# Altium schematic sheet 5V-and-3V3-buck.SchDoc
size Legal; SheetNumber: 6; SheetTotal: 7
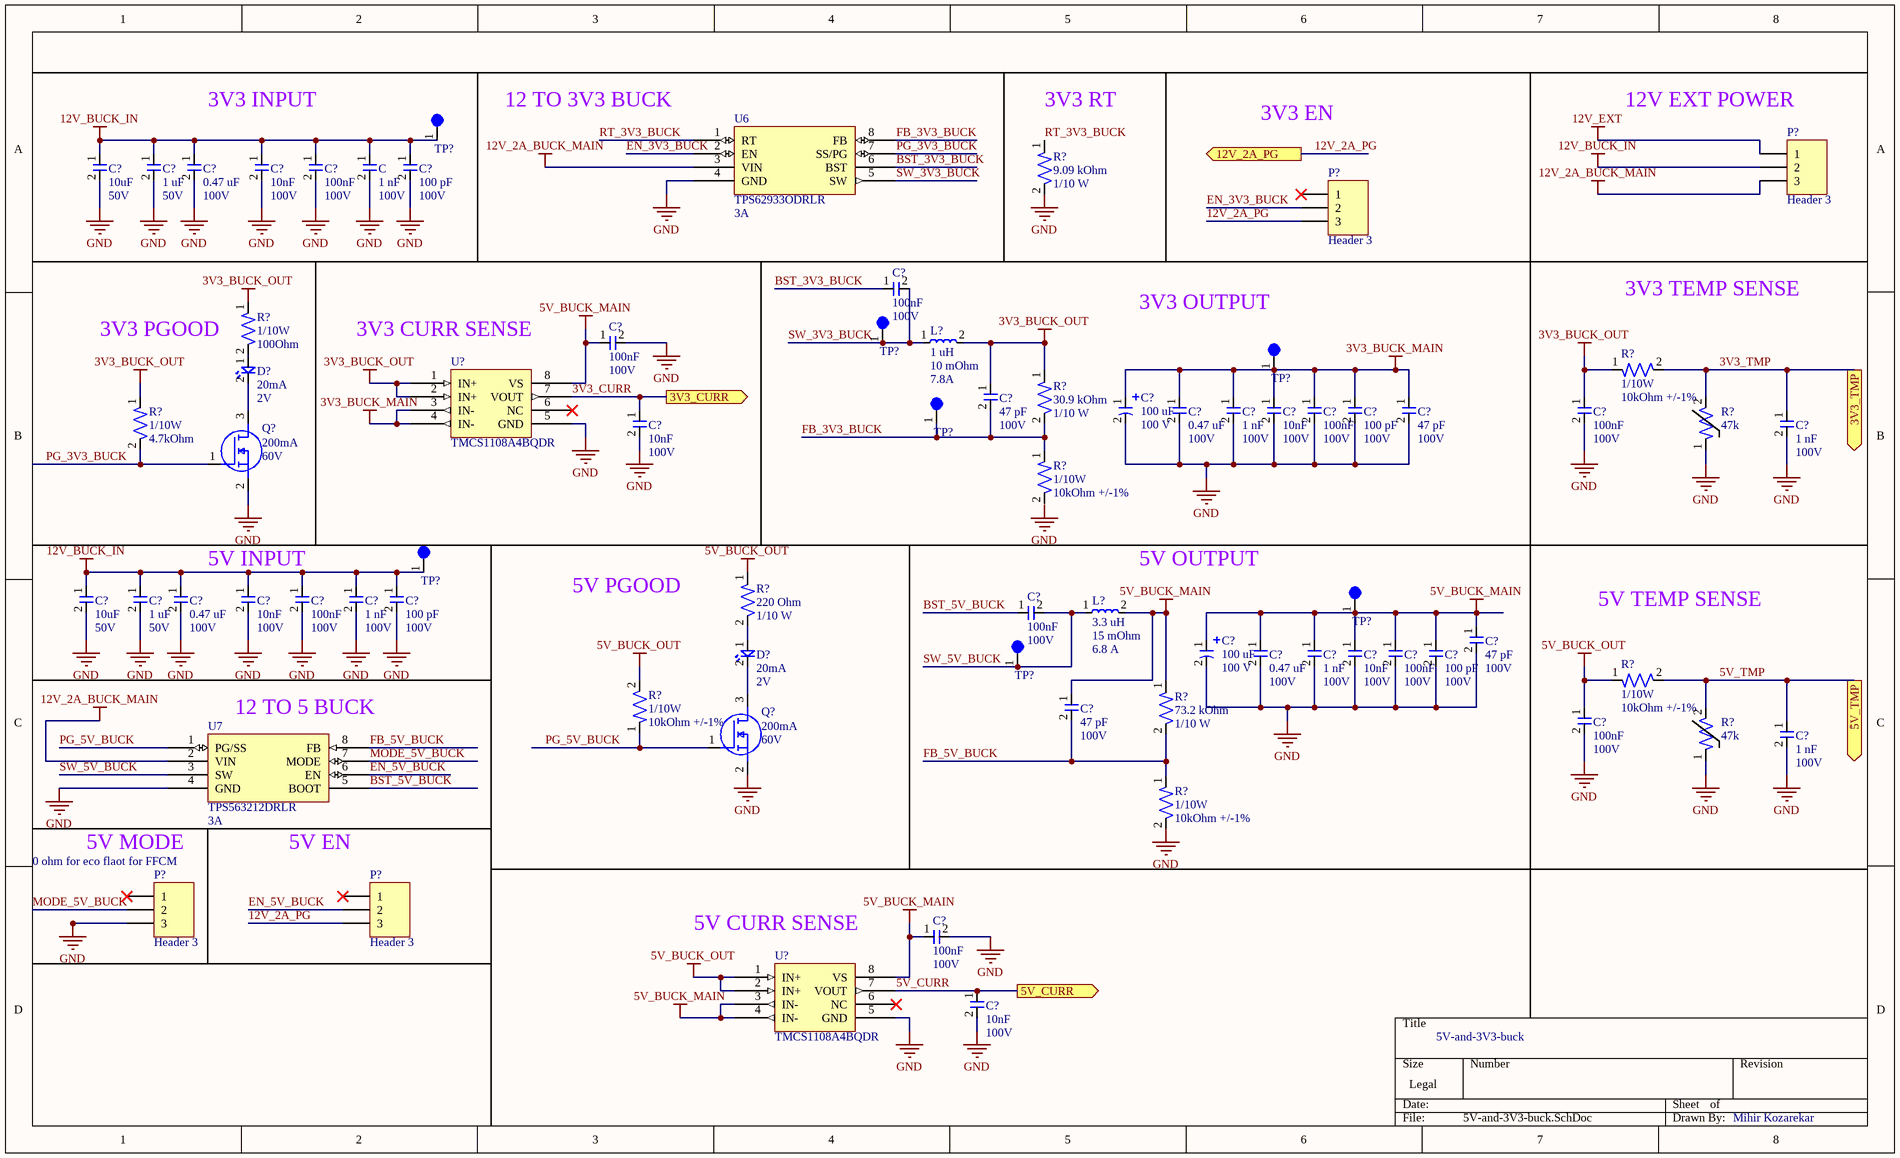
[diagram p0: 5V-and-3V3-buck.SchDoc]

## Parts
(Parts that share a designator on the sheet are numbered #1, #2 ... from top to bottom, then left to right.)
C  Capacitance: 1 nF  Voltage: 100V  [CAP-0603]  (hidden comment: C0603Y102K1RAC7867)
C?#1  Capacitance: 10uF  Voltage Rating: 50V  [CAP-1206]  (hidden comment: CL31B106KBHNNNE)
C?#2  Capacitance: 1 uF  Voltage: 50V  [CAP-0603]  (hidden comment: UMK107AB7105KA-T)
C?#3  Capacitance: 0.47 uF  Voltage: 100V  [CAP-0805]  (hidden comment: KAM21KR72A474KL)
C?#4  Capacitance: 10nF  Voltage Rating: 100V  [CAP-0603]  (hidden comment: C1608C0G2A103J080AC)
C?#5  Capacitance: 100nF  Voltage Rating: 100V  [CAP-0603]  (hidden comment: CC0603KRX7R0BB104)
C?#6  Capacitance: 100 pF  Voltage: 100V  [CAP-0603]  (hidden comment: 0603N101J101CT)
C?#7  Capacitance: 100nF  Voltage Rating: 100V  [CAP-0603]  (hidden comment: CC0603KRX7R0BB104)
C?#8  Capacitance: 100nF  Voltage Rating: 100V  [CAP-0603]  (hidden comment: CC0603KRX7R0BB104)
C?#9  Capacitance: 47 pF  Voltage Rating: 100V  [CAP-0603]  (hidden comment: 7447798111)
C?#10  Capacitance: 100 uF  Voltage: 100 V  [ELEC-100U-0001]  (hidden comment: 100SEV100M12.5X16)
C?#11  Capacitance: 0.47 uF  Voltage: 100V  [CAP-0805]  (hidden comment: KAM21KR72A474KL)
C?#12  Capacitance: 1 nF  Voltage: 100V  [CAP-0603]  (hidden comment: C0603Y102K1RAC7867)
C?#13  Capacitance: 10nF  Voltage Rating: 100V  [CAP-0603]  (hidden comment: C1608C0G2A103J080AC)
C?#14  Capacitance: 100nF  Voltage Rating: 100V  [CAP-0603]  (hidden comment: CC0603KRX7R0BB104)
C?#15  Capacitance: 100 pF  Voltage: 100V  [CAP-0603]  (hidden comment: 0603N101J101CT)
C?#16  Capacitance: 47 pF  Voltage Rating: 100V  [CAP-0603]  (hidden comment: 7447798111)
C?#17  Capacitance: 100nF  Voltage Rating: 100V  [CAP-0603]  (hidden comment: CC0603KRX7R0BB104)
C?#18  Capacitance: 10nF  Voltage Rating: 100V  [CAP-0603]  (hidden comment: C1608C0G2A103J080AC)
C?#19  Capacitance: 1 nF  Voltage: 100V  [CAP-0603]  (hidden comment: C0603Y102K1RAC7867)
C?#20  Capacitance: 10uF  Voltage Rating: 50V  [CAP-1206]  (hidden comment: CL31B106KBHNNNE)
C?#21  Capacitance: 1 uF  Voltage: 50V  [CAP-0603]  (hidden comment: UMK107AB7105KA-T)
C?#22  Capacitance: 0.47 uF  Voltage: 100V  [CAP-0805]  (hidden comment: KAM21KR72A474KL)
C?#23  Capacitance: 10nF  Voltage Rating: 100V  [CAP-0603]  (hidden comment: C1608C0G2A103J080AC)
C?#24  Capacitance: 100nF  Voltage Rating: 100V  [CAP-0603]  (hidden comment: CC0603KRX7R0BB104)
C?#25  Capacitance: 1 nF  Voltage: 100V  [CAP-0603]  (hidden comment: C0603Y102K1RAC7867)
C?#26  Capacitance: 100 pF  Voltage: 100V  [CAP-0603]  (hidden comment: 0603N101J101CT)
C?#27  Capacitance: 100nF  Voltage Rating: 100V  [CAP-0603]  (hidden comment: CC0603KRX7R0BB104)
C?#28  Capacitance: 47 pF  Voltage Rating: 100V  [CAP-0603]  (hidden comment: 7447798111)
C?#29  Capacitance: 100 uF  Voltage: 100 V  [ELEC-100U-0001]  (hidden comment: 100SEV100M12.5X16)
C?#30  Capacitance: 0.47 uF  Voltage: 100V  [CAP-0805]  (hidden comment: KAM21KR72A474KL)
C?#31  Capacitance: 1 nF  Voltage: 100V  [CAP-0603]  (hidden comment: C0603Y102K1RAC7867)
C?#32  Capacitance: 10nF  Voltage Rating: 100V  [CAP-0603]  (hidden comment: C1608C0G2A103J080AC)
C?#33  Capacitance: 100nF  Voltage Rating: 100V  [CAP-0603]  (hidden comment: CC0603KRX7R0BB104)
C?#34  Capacitance: 100 pF  Voltage: 100V  [CAP-0603]  (hidden comment: 0603N101J101CT)
C?#35  Capacitance: 47 pF  Voltage Rating: 100V  [CAP-0603]  (hidden comment: 7447798111)
C?#36  Capacitance: 100nF  Voltage Rating: 100V  [CAP-0603]  (hidden comment: CC0603KRX7R0BB104)
C?#37  Capacitance: 1 nF  Voltage: 100V  [CAP-0603]  (hidden comment: C0603Y102K1RAC7867)
C?#38  Capacitance: 100nF  Voltage Rating: 100V  [CAP-0603]  (hidden comment: CC0603KRX7R0BB104)
C?#39  Capacitance: 10nF  Voltage Rating: 100V  [CAP-0603]  (hidden comment: C1608C0G2A103J080AC)
D?#1  Current Rating: 20mA  Vf: 2V  [LED-0603]  (hidden comment: 150060AS75000)
D?#2  Current Rating: 20mA  Vf: 2V  [LED-0603]  (hidden comment: 150060AS75000)
L?#1  Inductance: 1 uH  DCR: 10 mOhm  DCI: 7.8A  [PWRIND-6.8U-0001]  (hidden comment: SRN8040-1R0Y)
L?#2  Inductance: 3.3 uH  DCR: 15 mOhm  DCI: 6.8 A  [PWRIND-3.3U-0003]  (hidden comment: SRR1240-3R3Y)
P?#1  Header 3  [HDR1X3]
P?#2  Header 3  [HDR1X3]
P?#3  Header 3  [HDR1X3]
P?#4  Header 3  [HDR1X3]
Q?#1  Id-Continuous: 200mA  VDS-Max: 60V  [NMOS-SOT23-3]  (hidden comment: T2N7002AK,LM)
Q?#2  Id-Continuous: 200mA  VDS-Max: 60V  [NMOS-SOT23-3]  (hidden comment: T2N7002AK,LM)
R?#1  Resistance: 9.09 kOhm  Power: 1/10 W  [RES-0603]  (hidden comment: RC0603FR-079K09L)
R?#2  Power Rating: 1/10W  Resistance: 100Ohm  [RES-0603]  (hidden comment: AC0603FR-10100RL)
R?#3  Power Rating: 1/10W  Resistance: 10kOhm +/-1%  [RES-0603]  (hidden comment: RC0603FR-0710KP)
R?#4  Resistance: 30.9 kOhm  Power: 1/10 W  [RES-0603]  (hidden comment: RC0603FR-0730K9L)
R?#5  Power Rating: 1/10W  Resistance: 4.7kOhm  [RES-0603]  (hidden comment: AF0603FR-074K7L)
R?#6  Resistance: 47k  [RES-0402]  (hidden comment: TMP6431DECR)
R?#7  Power Rating: 1/10W  Resistance: 10kOhm +/-1%  [RES-0603]  (hidden comment: RC0603FR-0710KP)
R?#8  Resistance: 220 Ohm  Power: 1/10 W  [RES-0603]  (hidden comment: CRGCQ0603J220R)
R?#9  Power Rating: 1/10W  Resistance: 10kOhm +/-1%  [RES-0603]  (hidden comment: RC0603FR-0710KP)
R?#10  Power Rating: 1/10W  Resistance: 10kOhm +/-1%  [RES-0603]  (hidden comment: RC0603FR-0710KP)
R?#11  Resistance: 73.2 kOhm  Power: 1/10 W  [RES-0603]  (hidden comment: RC0603FR-0773K2L)
R?#12  Resistance: 47k  [RES-0402]  (hidden comment: TMP6431DECR)
R?#13  Power Rating: 1/10W  Resistance: 10kOhm +/-1%  [RES-0603]  (hidden comment: RC0603FR-0710KP)
TP?#1  5003  [TEST-POINT-0001]  (value not drawn)
TP?#2  5003  [TEST-POINT-0001]  (value not drawn)
TP?#3  5003  [TEST-POINT-0001]  (value not drawn)
TP?#4  5003  [TEST-POINT-0001]  (value not drawn)
TP?#5  5003  [TEST-POINT-0001]  (value not drawn)
TP?#6  5003  [TEST-POINT-0001]  (value not drawn)
TP?#7  5003  [TEST-POINT-0001]  (value not drawn)
U6  TPS62933ODRLR  Current: 3A  [IC-SOT583]
U7  TPS563212DRLR  Current: 3A  [IC-SOT583]
U?#1  TMCS1108A4BQDR  [IC-CURRENT-0001]
U?#2  TMCS1108A4BQDR  [IC-CURRENT-0001]

## Ports
3V3_CURR (out), 3V3_TMP (out), 5V_CURR (out), 5V_TMP (out), 12V_2A_PG (out)

## Nets
3V3_BUCK_MAIN: C?#10.1 C?#11.1 C?#12.1 C?#13.1 C?#14.1 C?#15.1 C?#16.1 TP?#3.1 U?#1.3(IN-) U?#1.4(IN-)
3V3_BUCK_OUT: C?#9.1 C?#17.1 L?#1.2 R?#2.1 R?#3.1 R?#4.1 R?#5.1 U?#1.1(IN+) U?#1.2(IN+)
5V_BUCK_MAIN: C?#8.1 C?#28.1 C?#29.1 C?#30.1 C?#31.1 C?#32.1 C?#33.1 C?#34.1 C?#35.1 C?#38.1 L?#2.2 R?#11.1 TP?#6.1 U?#1.8(VS) U?#2.3(IN-) U?#2.4(IN-) U?#2.8(VS)
5V_BUCK_OUT: C?#36.1 R?#8.1 R?#9.1 R?#10.2 U?#2.1(IN+) U?#2.2(IN+)
12V_2A_BUCK_MAIN: P?#1.3 U6.3(VIN) U7.2(VIN)
12V_BUCK_IN: C.1 C?#1.1 C?#2.1 C?#3.1 C?#4.1 C?#5.1 C?#6.1 C?#20.1 C?#21.1 C?#22.1 C?#23.1 C?#24.1 C?#25.1 C?#26.1 P?#1.2 TP?#1.1 TP?#5.1
12V_EXT: P?#1.1
GND: C.2 C?#1.2 C?#2.2 C?#3.2 C?#4.2 C?#5.2 C?#6.2 C?#8.2 C?#10.2 C?#11.2 C?#12.2 C?#13.2 C?#14.2 C?#15.2 C?#16.2 C?#17.2 C?#18.2 C?#19.2 C?#20.2 C?#21.2 C?#22.2 C?#23.2 C?#24.2 C?#25.2 C?#26.2 C?#28.2 C?#29.2 C?#30.2 C?#31.2 C?#32.2 C?#33.2 C?#34.2 C?#36.2 C?#37.2 C?#38.2 C?#39.2 P?#3.3 Q?#1.2(S) Q?#2.2(S) R?#1.2 R?#6.1 R?#12.1 R?#13.2 U6.4(GND) U7.4(GND) U?#1.5(GND) U?#2.5(GND)
3V3_CURR: C?#18.1 U?#1.7(VOUT) ; port 3V3_CURR
3V3_TMP: C?#19.1 R?#3.2 R?#6.2 ; port 3V3_TMP
5V_CURR: C?#39.1 U?#2.7(VOUT) ; port 5V_CURR
5V_TMP: C?#37.1 R?#9.2 R?#12.2 ; port 5V_TMP
12V_2A_PG: P?#2.3 P?#4.3 ; port 12V_2A_PG
BST_3V3_BUCK: C?#7.1 U6.6(BST)
BST_5V_BUCK: C?#27.1 U7.5(BOOT)
EN_3V3_BUCK: P?#2.2 U6.2(EN)
EN_5V_BUCK: P?#4.2 U7.6(EN)
FB_3V3_BUCK: C?#9.2 R?#4.2 R?#7.1 TP?#4.1 U6.8(FB)
FB_5V_BUCK: C?#35.2 R?#11.2 R?#13.1 U7.8(FB)
MODE_5V_BUCK: P?#3.2 U7.7(MODE)
PG_3V3_BUCK: Q?#1.1(G) R?#5.2 U6.7(SS/PG)
PG_5V_BUCK: Q?#2.1(G) R?#10.1 U7.1(PG/SS)
RT_3V3_BUCK: R?#1.1 U6.1(RT)
SW_3V3_BUCK: C?#7.2 L?#1.1 TP?#2.1 U6.5(SW)
SW_5V_BUCK: C?#27.2 L?#2.1 TP?#7.1 U7.3(SW)
NetD?#1_1: D?#1.1 R?#2.2
NetD?#1_2: D?#1.2 Q?#1.3(D)
NetD?#2_1: D?#2.1 R?#8.2
NetD?#2_2: D?#2.2 Q?#2.3(D)

Not connected (* = marked no-connect by the designer): P?#2 1*; P?#3 1*; P?#4 1*; R?#7 2; U?#1 6(NC)*; U?#2 6(NC)*

## Notes on the sheet
- (near C?#4) 3V3 INPUT
- 12 TO 3V3 BUCK
- (near R?#1) 3V3 RT
- 3V3 EN
- (near P?#1) 12V EXT POWER
- 3V3 TEMP SENSE
- 3V3 PGOOD
- (near U?#1) 3V3 CURR SENSE
- (near TP?#3) 3V3 OUTPUT
- (near C?#23) 5V INPUT
- (near L?#2) 5V OUTPUT
- 5V PGOOD
- 5V TEMP SENSE
- (near U7) 12 TO 5 BUCK
- (near P?#3) 0 ohm for eco flaot for FFCM
- 5V MODE
- 5V EN
- (near U?#2) 5V CURR SENSE
- 5V-and-3V3-buck
- Mihir Kozarekar
- Labels drawn without touching a wire or pin: GND

## Library data of the parts
C C?#12 C?#19 C?#25 C?#31 C?#37 = CAP-1N-0001: 1000 pF ±10% 100V Ceramic Capacitor X7R 0603 (1608 Metric)
C?#1 C?#20 = CAP-10U-0001: 10 µF ±10% 50V Ceramic Capacitor X7R 1206 (3216 Metric); Manufacturer: Samsung Electro-Mechanics; Assembled?: no; Manufacturer Part Number: CL31B106KBHNNNE; Temperature Coefficient: X7R; Package Size: 1206
C?#2 C?#21 = CAP-1U-0002: 1 µF ±10% 50V Ceramic Capacitor X7R 0603 (1608 Metric); Package Size: 0603
C?#3 C?#11 C?#22 C?#30 = CAP-0.47U-0001: 0.47 µF ±10% 100V Ceramic Capacitor X7R 0805 (2012 Metric); Tolerance: +/- 10%; Assembled?: No; Temperature Coefficient: X7R; Package Size: 0805
C?#4 C?#13 C?#18 C?#23 C?#32 C?#39 = CAP-10N-0002: CAP CER 10000PF 100V C0G 0603; Manufacturer: TDK Corporation; Temperature Coefficient: C0G/NP0; Assembled?: no; Manufacturer Part Number: C1608C0G2A103J080AC; Package Size: 0603
C?#5 C?#7 C?#8 C?#14 C?#17 C?#24 C?#27 C?#33 C?#36 C?#38 = CAP-100N-0001: CAP CER 0.1UF 100V X7R 0603; Manufacturer: YAGEO; Assembled?: no; Manufacturer Part Number: CC0603KRX7R0BB104; Temperature Coefficient: X7R; Package Size: 0603
C?#6 C?#15 C?#26 C?#34 = CAP-100P-0002: 100 pF ±5% 100V Ceramic Capacitor C0G, NP0 0603 (1608 Metric); Tolerance: +/-5%; Temp Coeff: C0G/NP0; Package Size: 0603
C?#9 C?#16 C?#28 C?#35 = CAP-47P-0001: 47 pF ±5% 100V Ceramic Capacitor C0G, NP0 0603 (1608 Metric)
C?#10 C?#29 = ELEC-100U-0001: 100 µF 100 V Aluminum Electrolytic Capacitors Radial, Can - SMD 2000 Hrs @ 85°C; Manufacturer: Rubycon; Tolerance: +/- 20%; Assembled?: No; ESR: idk check the datasheet i couldnt find it
D?#1 D?#2 = LED_Amber_0001: CAP CER 0.1UF 100V X7R 0603; Manufacturer: Wurth Electronik; Assembled?: no; Color: Amber; Manufacturer Part Number: 150060AS75000; Package Size: 0603
L?#1 = PWRIND-1U-0001: 1 µH Semi-Shielded Drum Core, Wirewound Inductor 7.8 A 10mOhm Max Nonstandard; Isat: 11A; Tolerance: 30%; Assembled?: No
L?#2 = PWRIND-3.3U-0003: 3.3 µH Shielded Drum Core, Wirewound Inductor 6.8 A 15mOhm Max Nonstandard; Isat: 6.5A; Tolerance: 30%; Assembled?: No
P?#1-P?#4 = Header 3: Header, 3-Pin; LatestRevisionDate: 17-Jul-2002; LatestRevisionNote: Re-released for DXP Platform.; Publisher: Altium Limited
Q?#1 Q?#2 = NMOS-200MA-0001: MOSFET N-CH 60V 200MA SOT23; Manufacturer: Toshiba; FET type: N-Channel; Rds On-Max: 3.9Ohm; Vgs-Max: 20V; Assembled?: no; Manufacturer Part Number: T2N7002AK,LM; Package: SOT-23-3
R?#1 = RES-9.09K-0001: 9.09 kOhms ±1% 0.1W, 1/10W Chip Resistor 0603 (1608 Metric) Moisture Resistant Thick Film; Tolerance: +/-1%; Assembled?: No; Package Size: 0603
R?#2 = RES-100-0002: 100 Ohms ±1% 0.1W, 1/10W Chip Resistor 0603 (1608 Metric) Automotive AEC-Q200 Thick Film; Manufacturer: YAGEO; Assembled?: no; Manufacturer Part Number: AC0603FR-10100RL; Package Size: 0603
R?#3 R?#7 R?#9 R?#10 R?#13 = RES-10K-0002: RES SMD 10K OHM 1% 1/10W 0603; Manufacturer: YAGEO; Assembled?: no; Manufacturer Part Number: RC0603FR-0710KP; Package Size: 0603
R?#4 = RES-30.9K-0001: 30.9 kOhms ±1% 0.1W, 1/10W Chip Resistor 0603 (1608 Metric) Moisture Resistant Thick Film; Assembled?: No; Tolerance: 1%; Package Size: 0603
R?#5 = RES-4.7K-0002: RES SMD 4.7K OHM 1% 1/10W 0603; Manufacturer: YAGEO; Assembled?: no; Manufacturer Part Number: AF0603FR-074K7L; Package Size: 0603
R?#6 R?#12 = THERM-47K-0001: PTC Thermistor 47 kOhms 0402 (1006 Metric); Manufacturer: Texas Instruments; Manufacturer Part Number: TMP6431DECR; Package Size: 0402
R?#8 = RES-220-003: 220 Ohms ±5% 0.1W, 1/10W Chip Resistor 0603 (1608 Metric) Automotive AEC-Q200, Moisture Resistant Thick Film; Tolerance: +/- 5%; Package Size: 0603
R?#11 = RES-73.2K-0001: 73.2 kOhms ±1% 0.1W, 1/10W Chip Resistor 0603 (1608 Metric) Moisture Resistant Thick Film; Assembled?: No; Tolerance: 1%; Package Size: 0603
TP?#1-TP?#7 = TEST-POINT-0001: Oranange PC Test Point, Miniature Phoisphor Bronze Silver Plating Through Hole Mounting Type
U6 = IC-BUCK-0010: Buck Switching Regulator IC Positive Adjustable 0.8V 1 Output 3A SOT-583; Manufacturer: Texas Instruments; Assembled?: no; Manufacturer Part Number: TPS62933ODRLR; Type: Buck
U7 = IC-BUCK-0008: Buck Switching Regulator IC Positive Adjustable 0.6V 1 Output 3A SOT-583; Manufacturer: Texaas Instruments; Assembled?: no; Manufacturer Part Number: TPS563212DRLR; Type: Buck; Package Size: SOT-583
U?#1 U?#2 = IC-CURRENT-0004: Current Sensor 1 Channel Hall Effect Bidirectional 8-SOIC (0.154", 3.90mm Width); Assembled?: No; Supply Voltage: 5V; Footprint: 8-SOIC